# Altium project FitC_Project.PrjPcb (part 2 of 2)

## Sheet Microcontroller_Power_&_RF.SchDoc: Microcontroller Power and RF
size A; DrawnBy: FitC Engineers; Revision: 1; SheetNumber: 3; SheetTotal: 5
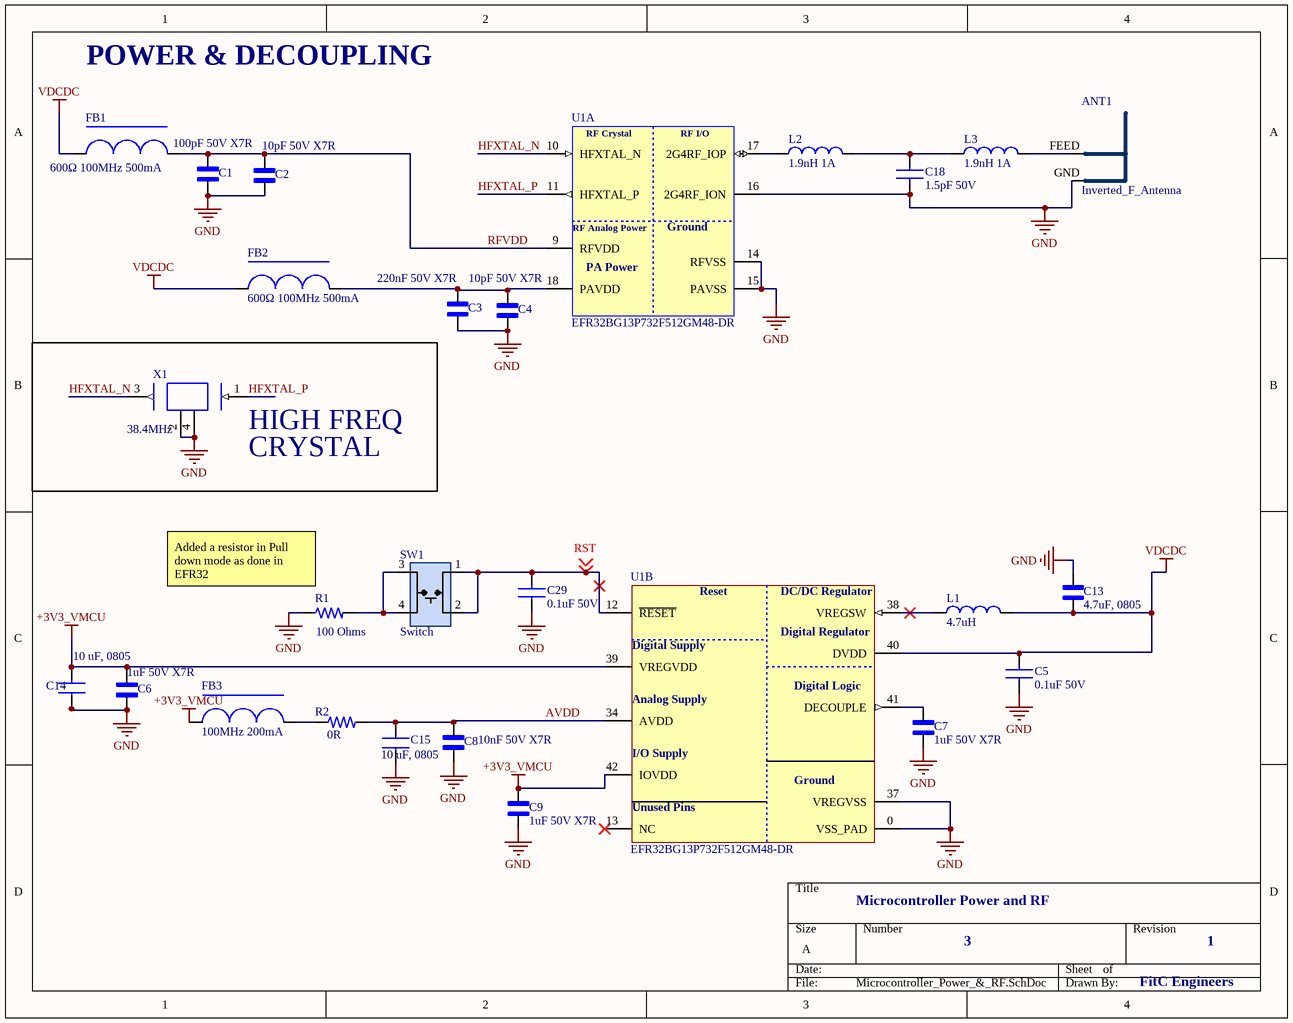
[diagram p2: Microcontroller_Power_&_RF.SchDoc]

### Parts
ANT1  Inverted_F_Antenna  [INV_F_Antenna]  (net tie, no BOM)
C1  100pF 50V X7R  [CAP_0603_1MM]
C2  10pF 50V X7R  [CAP_0603_1MM]
C3  220nF 50V X7R  [CAP_0603_1MM]
C4  10pF 50V X7R  [CAP_0603_1MM]
C5  0.1uF 50V  [CAP_0603_1MM]
C6  1uF 50V X7R  [CAP_0603_1MM]
C7  1uF 50V X7R  [CAP_0603_1MM]
C8  10nF 50V X7R  [CAP_0603_1MM]
C9  1uF 50V X7R  [CAP_0603_1MM]
C13  4.7uF, 0805  [CAP_0805_2012X14]
C14  10 uF, 0805  [CAP_0805_2012X14]
C15  10 uF, 0805  [CAP_0805_2012X14]
C18  1.5pF 50V  [CAP_0402_1mm]
C29  0.1uF 50V  [CAP_0603_1MM]
FB1  600Ω 100MHz 500mA  [RES_0603_1608X06]
FB2  600Ω 100MHz 500mA  [RES_0603_1608X06]
FB3  100MHz 200mA  [RES_0603_1608X06]
L1  4.7uH  [VLS201612CX-100M-1]
L2  1.9nH 1A  [CAP_0402_1mm]
L3  1.9nH 1A  [CAP_0402_1mm]
R1  100 Ohms  [RES_0603_1608X06]
R2  0R  [RES_0603_1608X06]
SW1  Switch  [SWITCH]
U1  EFR32BG13P732F512GM48-DR  [EFR32BG13_48_QFN]  (parts A,B of 3)
X1  38.4MHz  [OSC_38.4MHz]

### Nets
+3V3_VMCU: C6.1 C9.1 C14.2 FB3.1 U1.39(VREGVDD) U1.42(IOVDD)
GND: ANT1.GND C1.2 C2.2 C3.2 C4.2 C5.2 C6.2 C7.2 C8.2 C9.2 C13.1 C14.1 C15.1 C18.2 C29.2 R1.1 U1.0(VSS_PAD) U1.14(RFVSS) U1.15(PAVSS) U1.16(2G4RF_ION) U1.37(VREGVSS) X1.2 X1.4
VDCDC: C5.1 C13.2 FB1.1 FB2.1 L1.2 U1.40(DVDD)
AVDD: C8.1 C15.2 R2.2 U1.34(AVDD)
HFXTAL_N: U1.10(HFXTAL_N) X1.3
HFXTAL_P: U1.11(HFXTAL_P) X1.1
RFVDD: C1.1 C2.1 FB1.2 U1.9(RFVDD)
RST: C29.1 SW1.1 SW1.2 U1.12(~{RESET}) ; off-sheet RST
NetANT1_FEED: ANT1.FEED L3.2
NetC3_1: C3.1 C4.1 FB2.2 U1.18(PAVDD)
NetC7_1: C7.1 U1.41(DECOUPLE)
NetC18_1: C18.1 L2.2 L3.1
NetFB3_2: FB3.2 R2.1
NetL1_1: L1.1 U1.38(VREGSW)
NetL2_1: L2.1 U1.17(2G4RF_IOP)
NetR1_2: R1.2 SW1.3 SW1.4

Not connected (* = marked no-connect by the designer): U1 13(NC)*

### Notes on the sheet
- POWER & DECOUPLING
- (near X1) HIGH FREQ
- (near X1) CRYSTAL
- (near R1) Added a resistor in Pull down mode as done in EFR32
- (in symbol EFR32BG13P732F512GM48-DR, part A) RF Crystal; RF I/O; RF Analog Power; Ground; PA Power
- (in symbol EFR32BG13P732F512GM48-DR, part B) Reset; DC/DC Regulator; Digital Regulator; Digital Supply; Digital Logic; Analog Supply; I/O Supply; Ground; Unused Pins

### Library data of the parts
ANT1 = Inv_F_Antenna
C1 = CL10B101KB8NFNC: 100pF ±10% 50V 0603; Manufacturer: Samsung; Supplier 1: Digi-Key; Manufacturer Part Number: CL10B101KB8NFNC; RoHS: Yes; Category: Ceramic Capacitors; Stock 1: 222247; Pricing 1: 1=0.10000, 10=0.04200, 50=0.02260, 100=0.01850, 500=0.01320, 1000=0.01038 (USD); Mount: Surface Mount; Case/Package: 0603; Case Code (Metric): 1608; Case Code (Imperial): 0603; Contact Plating: Tin; Min Operating Temperature: -55°C; Max Operating Temperature: 125°C; Package Quantity: 1; Packaging: Cut Tape; Capacitance: 100pF; Tolerance: 10%; Voltage Rating: 50V; Dielectric: X7R; Termination: Wraparound; Series: CL; Construction: Flat; Length: 0.063inch; Width: 0.031inch; Thickness: 0.035inch; RoHS Compliant: Yes; ComponentLink1URL: https://datasheet.ciiva.com/25739/cl10b101kb8nfnc-25739520.pdf?src-supplier=Digi-Key; ComponentLink1Description: https://datasheet.ciiva.com/25739/cl10b101kb8nfnc-25739520.pdf?src-supplier=Digi-Key; Supplier Part Number 1: 1276-1908-6-ND
C2 C4 = 06035C100KAT2A: 0603 10 pF 50 V ±10 % Tolerance X7R Surface Mount Multilayer Ceramic Capacitor; Manufacturer: Kyocera AVX; Tolerance: 10%; Supplier 1: Digi-Key; Manufacturer Part Number: 06035C100KAT2A; RoHS: Yes; Category: Ceramic Capacitors; Stock 1: 15388; Pricing 1: 1=0.22000, 10=0.14800, 50=0.08920, 100=0.07520, 500=0.05148, 1000=0.04554 (USD); Mount: Surface Mount; Case/Package: 0603; Number of Pins: 2; Case Code (Metric): 1608; Case Code (Imperial): 0603; Min Operating Temperature: -55°C; Max Operating Temperature: 125°C; Capacitance: 10pF; Voltage Rating: 50V; Packaging: Tape and Reel; Package Quantity: 4000; Dielectric: X7R; Termination: SMD/SMT; Voltage Rating (DC): 50V; Series: -; Construction: Flat; Length: 1.6mm; Width: 0.032inch; Thickness: 0.035inch; Depth: 0.81mm; Radiation Hardening: No; REACH SVHC: Unknown; Lead Free: Lead Free; RoHS Compliant: Yes; ComponentLink1URL: https://datasheet.ciiva.com/204/cx7r-204167.pdf?src-supplier=Digi-Key; ComponentLink1Description: https://datasheet.ciiva.com/204/cx7r-204167.pdf?src-supplier=Digi-Key; ComponentLink2URL: https://datasheet.ciiva.com/5416/cx7r-5416268.pdf?src-supplier=Mouser; ComponentLink2Description: https://datasheet.ciiva.com/5416/cx7r-5416268.pdf?src-supplier=Mouser; ComponentLink3URL: https://datasheet.ciiva.com/28611/1679506-28611544.pdf?src-supplier=Element14; ComponentLink3Description: https://datasheet.ciiva.com/28611/1679506-28611544.pdf?src-supplier=Element14; ComponentLink4URL: https://datasheet.ciiva.com/15212/getdatasheetpartid-317346-15212284.pdf?src-supplier=Verical; ComponentLink4Description: https://datasheet.ciiva.com/15212/getdatasheetpartid-317346-15212284.pdf?src-supplier=Verical; ComponentLink5URL: https://datasheet.ciiva.com/16327/cx7r-16327067.pdf?src-supplier=Future+Electronics; ComponentLink5Description: https://datasheet.ciiva.com/16327/cx7r-16327067.pdf?src-supplier=Future+Electronics; ComponentLink6URL: https://datasheet.ciiva.com/22677/1679506-22677033.pdf?src-supplier=Element14; ComponentLink6Description: https://datasheet.ciiva.com/22677/1679506-22677033.pdf?src-supplier=Element14; Supplier Part Number 1: 478-11375-1-ND
C3 = C1608X7R1H224K080AB: C Series 0603 0.22 uF 50 V ±10 % Tolerance X7R SMT Multilayer Ceramic Capacitor; Manufacturer: TDK; Tolerance: 10%; Supplier 1: Digi-Key; Manufacturer Part Number: C1608X7R1H224K080AB; RoHS: Yes; Category: Ceramic Capacitors; Stock 1: 272861; Pricing 1: 1=0.18000, 10=0.12400, 50=0.07420, 100=0.06270, 500=0.04290, 1000=0.03795 (USD); Mount: Surface Mount; Case/Package: 0603; Number of Pins: 2; Case Code (Metric): 1608; Case Code (Imperial): 0603; Weight: 7.1E-05oz; Dielectric Material: Ceramic; Min Operating Temperature: -55°C; Max Operating Temperature: 125°C; Packaging: Tape and Reel; Package Quantity: 1; Series: C; Capacitance: 220nF; Voltage Rating: 50V; Voltage Rating (DC): 50V; Dielectric: X7R; Termination: SMD/SMT; Resistor Type: Ceramic; Voltage: 50V; Construction: Flat; Length: 1.6mm; Width: 0.031inch; Height: 0.8mm; Thickness: 0.035inch; Depth: 0.8mm; Radiation Hardening: No; REACH SVHC: No SVHC; Lead Free: Lead Free; RoHS Compliant: Yes; ComponentLink1URL: https://datasheet.ciiva.com/26919/getdatasheetpartid-756131-26919196.pdf?src-supplier=Verical; ComponentLink1Description: https://datasheet.ciiva.com/26919/getdatasheetpartid-756131-26919196.pdf?src-supplier=Verical; ComponentLink2URL: https://datasheet.ciiva.com/6291/tdkmlcccaprange-6291851.pdf?src-supplier=Digi-Key; ComponentLink2Description: https://datasheet.ciiva.com/6291/tdkmlcccaprange-6291851.pdf?src-supplier=Digi-Key; ComponentLink3URL: https://datasheet.ciiva.com/6291/tdkmlcccaprange-6291855.pdf?src-supplier=Digi-Key; ComponentLink3Description: https://datasheet.ciiva.com/6291/tdkmlcccaprange-6291855.pdf?src-supplier=Digi-Key; ComponentLink4URL: https://datasheet.ciiva.com/28693/1735394-28693453.pdf?src-supplier=Element14; ComponentLink4Description: https://datasheet.ciiva.com/28693/1735394-28693453.pdf?src-supplier=Element14; ComponentLink5URL: https://datasheet.ciiva.com/16427/e412-c-16427784.pdf?src-supplier=Future+Electronics; ComponentLink5Description: https://datasheet.ciiva.com/16427/e412-c-16427784.pdf?src-supplier=Future+Electronics; ComponentLink6URL: https://datasheet.ciiva.com/23803/1735394-23803003.pdf?src-supplier=Newark; ComponentLink6Description: https://datasheet.ciiva.com/23803/1735394-23803003.pdf?src-supplier=Newark; Supplier Part Number 1: 445-7408-1-ND
C5 C29 = C0603X104K5RAC3121: Cap Ceramic 0.1uF 50V X7R 10% Pad SMD 0603 Flexible Termination 125C Automotive Medical Bag; Manufacturer: KEMET; Supplier 1: Digi-Key; Manufacturer Part Number: C0603X104K5RAC3121; RoHS: No; Category: Ceramic Capacitors; Stock 1: 4337; Pricing 1: 1=0.21000, 10=0.14400, 50=0.08660, 100=0.07320, 500=0.05004, 1000=0.04428 (USD); ComponentLink1URL: https://www.verical.com/server-webapp/html/getDatasheet?partID=788232&src-supplier=Verical; ComponentLink1Description: https://www.verical.com/server-webapp/html/getDatasheet?partID=788232&src-supplier=Verical; Supplier Part Number 1: 399-C0603X104K5RAC3121CT-ND
C6 C7 C9 = 06035C105KAT2A: 0603 1uF Multilayer Ceramic Capacitors 0603 50V X7R 105 10% TOL; Manufacturer: Kyocera AVX; Supplier 1: Digi-Key; Manufacturer Part Number: 06035C105KAT2A; RoHS: Yes; Category: Ceramic Capacitors; Stock 1: 65385; Pricing 1: 1=0.56000, 10=0.39700, 50=0.30000, 100=0.26140, 500=0.19360, 1000=0.16456 (USD); Case/Package: 0603; Capacitance: 1uF; Tolerance: 10%; Dielectric: X7R; Voltage Rating (DC): 50V; RoHS Compliant: Yes; ComponentLink1URL: http://catalogs.avx.com/SurfaceMount.pdf?src-supplier=Digi-Key; ComponentLink1Description: http://catalogs.avx.com/SurfaceMount.pdf?src-supplier=Digi-Key; ComponentLink2URL: http://datasheets.avx.com/X7RDielectric.pdf?src-supplier=Digi-Key; ComponentLink2Description: http://datasheets.avx.com/X7RDielectric.pdf?src-supplier=Digi-Key; Supplier Part Number 1: 478-10073-1-ND
C8 = CL10B103KB8WPJC: Capacitor Ceramic 0.01uF 10% 50V 2-Pin Surface Mount T/R; Manufacturer: Samsung; Supplier 1: Digi-Key; Manufacturer Part Number: CL10B103KB8WPJC; RoHS: Yes; Category: Ceramic Capacitors; Stock 1: 23609; Pricing 1: 1=0.11000, 10=0.08100, 50=0.04620, 100=0.03830, 500=0.02684, 1000=0.02222 (USD); RoHS Compliant: Yes; Supplier Part Number 1: 1276-CL10B103KB8WPJCCT-ND
C13 = CC0805KKX5R8BB475: 0805 4.7 uF 25 V ±10% Tolerance X5R SMT Multilayer Ceramic Capacitor; Manufacturer: Yageo; Voltage Rating (DC): 25V; Supplier 1: Digi-Key; Manufacturer Part Number: CC0805KKX5R8BB475; RoHS: Yes; Category: Ceramic Capacitors; Stock 1: 260911; Pricing 1: 1=0.39000, 10=0.27000, 50=0.18940, 100=0.16230, 500=0.12172, 1000=0.10278 (USD); Mount: Surface Mount; Case/Package: 0805; Case Code (Imperial): 0805; Case Code (Metric): 2012; Weight: 0.000194oz; Min Operating Temperature: -55°C; Max Operating Temperature: 85°C; Tolerance: 10%; Packaging: Tape and Reel; Capacitance: 4.7uF; Voltage Rating: 25V; Dielectric: X5R; Termination: SMD/SMT; Resistor Type: Ceramic; Series: CC; Construction: Flat; Length: 2mm; Width: 0.049inch; Height: 1.25mm; Thickness: 0.057inch; Depth: 1.25mm; Radiation Hardening: No; Lead Free: Lead Free; Halogen Free: Halogen Free; RoHS Compliant: Yes; ComponentLink1URL: https://datasheet.ciiva.com/26946/getdatasheetpartid-788588-26946123.pdf?src-supplier=Verical; ComponentLink1Description: https://datasheet.ciiva.com/26946/getdatasheetpartid-788588-26946123.pdf?src-supplier=Verical; Supplier Part Number 1: 311-1871-1-ND
C14 C15 = GRM21BR61E106KA73K: 0805 25 V 10 uF ±20% Tolerance X5R Monolithic Ceramic Chip Capacitor; Manufacturer: Murata; Capacitance: 10uF; Voltage Rating: 25V; Tolerance: 10%; Supplier 1: Digi-Key; Manufacturer Part Number: GRM21BR61E106KA73K; RoHS: Yes; Category: Ceramic Capacitors; Stock 1: 451324; Pricing 1: 1=0.21000, 10=0.14400, 50=0.08640, 100=0.07290, 500=0.04990, 1000=0.04414, 2500=0.04222, 5000=0.03838 (USD); Mount: Surface Mount; Case/Package: 0805; Weight: 0.000335oz; Min Operating Temperature: -55°C; Max Operating Temperature: 85°C; Packaging: Tape and Reel; Package Quantity: 10000; Dielectric: X5R; Voltage Rating (DC): 25V; Length: 0.079inch; Width: 0.049inch; Thickness: 0.055inch; RoHS Compliant: Yes; ComponentLink1URL: http://www.mouser.com/ds/2/281/c02e-2905.pdf?src-supplier=Mouser; ComponentLink1Description: http://www.mouser.com/ds/2/281/c02e-2905.pdf?src-supplier=Mouser; ComponentLink2URL: http://search.murata.co.jp/Ceramy/image/img/A01X/G101/ENG/GRM21BR61E106KA73-01.pdf?src-supplier=Digi-Key; ComponentLink2Description: http://search.murata.co.jp/Ceramy/image/img/A01X/G101/ENG/GRM21BR61E106KA73-01.pdf?src-supplier=Digi-Key; ComponentLink3URL: https://search.murata.co.jp/Ceramy/image/img/A01X/G101/ENG/GRM21BR61E106KA73-01.pdf?src-supplier=Digi-Key; ComponentLink3Description: https://search.murata.co.jp/Ceramy/image/img/A01X/G101/ENG/GRM21BR61E106KA73-01.pdf?src-supplier=Digi-Key
C18 = GCM1555C1H1R5JA16D: Cap Ceramic 1.5pF 50V C0G 5% Pad SMD 0402 125C Automotive T/R; Manufacturer: Murata; Supplier 1: Digi-Key; Manufacturer Part Number: GCM1555C1H1R5JA16D; RoHS: Yes; Category: Ceramic Capacitors; Stock 1: 77943; Pricing 1: 1=0.10000, 10=0.04700, 50=0.02580, 100=0.02100, 500=0.01502, 1000=0.01180, 2500=0.01072, 5000=0.00987 (USD); Mount: Surface Mount; Case/Package: 0402; Case Code (Imperial): 0402; Case Code (Metric): 1005; Min Operating Temperature: -55°C; Max Operating Temperature: 125°C; Packaging: Cut Tape; Capacitance: 1.5pF; Tolerance: 5%; Voltage Rating: 50V; Ratings: AEC-Q200; ComponentLink1URL: http://search.murata.co.jp/Ceramy/image/img/A01X/G101/ENG/GCM1555C1H1R5JA16-01.pdf?src-supplier=Digi-Key; ComponentLink1Description: http://search.murata.co.jp/Ceramy/image/img/A01X/G101/ENG/GCM1555C1H1R5JA16-01.pdf?src-supplier=Digi-Key
FB1 FB2 = BLM18AG601SN1D: 0603 600Ω ±25% DCR=0.38Ω 500mA; Manufacturer: Murata; Core Material: Ferrite; Material: Steel,Ferrite; Impedance: 600R; Number of Lines: 1; DC Resistance (DCR): 380mR; Shielding: Unshielded; Supplier 1: Arrow Electronics; Manufacturer Part Number: BLM18AG601SN1D; RoHS: Yes; Category: Inductors; Stock 1: 2284000; Pricing 1: 4000=0.02260, 8000=0.02040, 12000=0.01980, 28000=0.01830, 100000=0.01810 (USD); Case/Package: 0603; Number of Pins: 2; Case Code (Metric): 1608; Case Code (Imperial): 0603; Weight: 7.1E-05oz; Min Operating Temperature: -55°C; Max Operating Temperature: 125°C; Package Quantity: 1; Packaging: Tape and Reel; Frequency: 100MHz; Tolerance: 25%; Max Current Rating: 500mA; Current Rating: 500mA; Termination: SMD/SMT; Max DC Current: 500mA; Test Frequency: 100MHz; DC Current: 500mA; Number of Circuits: 1; Length: 1.6mm; Width: 0.8mm; Height: 0.8mm; Depth: 0.8mm; Radiation Hardening: No; RoHS Compliant: Yes; Lead Free: Lead Free; REACH SVHC: No SVHC; Military Standard: Not; ComponentLink1URL: https://datasheet.ciiva.com/19460/1844766-19460213.pdf?src-supplier=Jameco; ComponentLink1Description: https://datasheet.ciiva.com/19460/1844766-19460213.pdf?src-supplier=Jameco; ComponentLink2URL: https://datasheet.ciiva.com/41449/001172228-da-01-en-drossel-0603-600r-1-6x0-8mm-4000st-41449517.pdf?src-supplier=Conrad; ComponentLink2Description: https://datasheet.ciiva.com/41449/001172228-da-01-en-drossel-0603-600r-1-6x0-8mm-4000st-41449517.pdf?src-supplier=Conrad; ComponentLink3URL: https://datasheet.ciiva.com/29347/442309-da-01-en-chip-drossel-0603-600r-500ma-1-6x0-8mm-29347900.pdf?src-supplier=Conrad; ComponentLink3Description: https://datasheet.ciiva.com/29347/442309-da-01-en-chip-drossel-0603-600r-500ma-1-6x0-8mm-29347900.pdf?src-supplier=Conrad; ComponentLink4URL: https://datasheet.ciiva.com/1466/1756147-1466934.pdf?src-supplier=Element14; ComponentLink4Description: https://datasheet.ciiva.com/1466/1756147-1466934.pdf?src-supplier=Element14; ComponentLink5URL: https://datasheet.ciiva.com/1466/1756147-1466933.pdf?src-supplier=Element14; ComponentLink5Description: https://datasheet.ciiva.com/1466/1756147-1466933.pdf?src-supplier=Element14; ComponentLink6URL: https://datasheet.ciiva.com/1012/l0110s0100blm18a-1012018.pdf?src-supplier=Digi-Key; ComponentLink6Description: https://datasheet.ciiva.com/1012/l0110s0100blm18a-1012018.pdf?src-supplier=Digi-Key; ComponentLink7URL: https://datasheet.ciiva.com/1012/l0110s0100blm18a-1012017.pdf?src-supplier=Digi-Key; ComponentLink7Description: https://datasheet.ciiva.com/1012/l0110s0100blm18a-1012017.pdf?src-supplier=Digi-Key; ComponentLink8URL: https://datasheet.ciiva.com/1012/l0110s0100blm18a-1012019.pdf?src-supplier=Digi-Key; ComponentLink8Description: https://datasheet.ciiva.com/1012/l0110s0100blm18a-1012019.pdf?src-supplier=Digi-Key; ComponentLink9URL: https://datasheet.ciiva.com/16210/l0110s0100blm18a-16210006.pdf?src-supplier=Future+Electronics; ComponentLink9Description: https://datasheet.ciiva.com/16210/l0110s0100blm18a-16210006.pdf?src-supplier=Future+Electronics; ComponentLink10URL: https://datasheet.ciiva.com/3081/l0110s0100blm18a-3081613.pdf?src-supplier=Avnet; ComponentLink10Description: https://datasheet.ciiva.com/3081/l0110s0100blm18a-3081613.pdf?src-supplier=Avnet; Supplier Part Number 1: BLM18AG601SN1D
FB3 = 74279266: Ferrite Beads WE-CBF 0603 SMD Bead 100MHz 1000Ohm 200mA; Manufacturer: Wurth Electronics; Tolerance: 25%; Impedance: 1kR; DC Resistance (DCR): 600mR; Inductance: 1.8nH; Shielding: Unshielded; Number of Lines: 1; Supplier 1: Digi-Key; Manufacturer Part Number: 74279266; RoHS: Yes; Category: Ferrite Beads and Chips; Stock 1: 167539; Pricing 1: 1=0.18000, 50=0.17400, 100=0.16000, 500=0.15300, 1000=0.14600, 2000=0.13900 (USD); Case/Package: SMD/SMT; Case Code (Metric): 1608; Case Code (Imperial): 0603; Core Material: Ferrite; Min Operating Temperature: -55°C; Max Operating Temperature: 125°C; Packaging: Tape and Reel; Series: WE-CBF; Current Rating: 200mA; Max DC Current: 200mA; Termination: SMD/SMT; Test Frequency: 100MHz; Max Current Rating: 200mA; Length: 1.6mm; Width: 0.8mm; Height: 0.8mm; Depth: 0.8mm; REACH SVHC: Unknown; Lead Free: Lead Free; RoHS Compliant: Yes; ComponentLink1URL: https://datasheet.ciiva.com/23763/74279266-23763009.pdf?src-supplier=Newark; ComponentLink1Description: https://datasheet.ciiva.com/23763/74279266-23763009.pdf?src-supplier=Newark; ComponentLink2URL: https://datasheet.ciiva.com/11799/0900766b801ef1d0-11799352.pdf?src-supplier=RSComponents; ComponentLink2Description: https://datasheet.ciiva.com/11799/0900766b801ef1d0-11799352.pdf?src-supplier=RSComponents; ComponentLink3URL: https://datasheet.ciiva.com/12395/74279266-221135-12395453.pdf?src-supplier=Mouser; ComponentLink3Description: https://datasheet.ciiva.com/12395/74279266-221135-12395453.pdf?src-supplier=Mouser; ComponentLink4URL: https://datasheet.ciiva.com/14971/74279266-14971192.pdf?src-supplier=Digi-Key; ComponentLink4Description: https://datasheet.ciiva.com/14971/74279266-14971192.pdf?src-supplier=Digi-Key; ComponentLink5URL: https://datasheet.ciiva.com/14634/0900766b801ef1d0-14634816.pdf?src-supplier=Allied+Electronics; ComponentLink5Description: https://datasheet.ciiva.com/14634/0900766b801ef1d0-14634816.pdf?src-supplier=Allied+Electronics; ComponentLink6URL: https://datasheet.ciiva.com/1466/1705901-1466509.pdf?src-supplier=Element14; ComponentLink6Description: https://datasheet.ciiva.com/1466/1705901-1466509.pdf?src-supplier=Element14; ComponentLink7URL: https://datasheet.ciiva.com/22711/1705901-22711422.pdf?src-supplier=Element14; ComponentLink7Description: https://datasheet.ciiva.com/22711/1705901-22711422.pdf?src-supplier=Element14; ComponentLink8URL: https://datasheet.ciiva.com/48698/001087059-da-01-ml-we-cbf-smd-ferrit-74279266-de-en-48698427.pdf?src-supplier=Conrad; ComponentLink8Description: https://datasheet.ciiva.com/48698/001087059-da-01-ml-we-cbf-smd-ferrit-74279266-de-en-48698427.pdf?src-supplier=Conrad; Supplier Part Number 1: 732-4484-1-ND
L1 = VLS201612CX-4R7M-1: 4.7uH Inductor Power Shielded Wirewound  20% 1MHz Ferrite 1.12A 0.252Ohm DCR 0806 T/R; Manufacturer: TDK; Saturation Current: 880mA; DC Resistance (DCR): 252mR; Supplier 1: Digi-Key; Manufacturer Part Number: VLS201612CX-4R7M-1; RoHS: Yes; Category: Fixed Inductors; Stock 1: 74990; Pricing 1: 1=0.41000, 10=0.36200, 25=0.31640, 50=0.27120, 100=0.24860, 250=0.22600, 500=0.21246, 1000=0.16273 (USD); Mount: Surface Mount; Case/Package: Nonstandard; Core Material: Ferrite; Min Operating Temperature: -40°C; Max Operating Temperature: 105°C; Resistor Type: Wirewound; Packaging: Cut Tape; Inductance: 4.7uH; Tolerance: 20%; Current Rating: 1.12A; Shielding: Shielded; Test Frequency: 1MHz; RoHS Compliant: Yes; ComponentLink1URL: https://product.tdk.com/info/en/catalog/datasheets/inductor_commercial_power_vls201612cx-1_en.pdf?src-supplier=Digi-Key; ComponentLink1Description: https://product.tdk.com/info/en/catalog/datasheets/inductor_commercial_power_vls201612cx-1_en.pdf?src-supplier=Digi-Key; Supplier Part Number 1: 445-172965-1-ND
L2 L3 = LQG15WZ1N9S02D: Inductor Chip 1.9nH 0.3nH Tolerance 2-Pin 0402 Paper T/R; Manufacturer: Murata; Supplier 1: Digi-Key; Manufacturer Part Number: LQG15WZ1N9S02D; RoHS: Yes; Category: Fixed Inductors; Stock 1: 7252; Pricing 1: 1=0.14000, 10=0.12900, 25=0.11440, 50=0.09720, 100=0.08580, 250=0.07864, 500=0.07150, 1000=0.06006, 2500=0.05148 (USD); RoHS Compliant: Yes
R1 = RT0603BRD07100RL: Res Thin Film 0603 100 Ohm 0.1% 0.1W(1/10W) ±25ppm/C Pad SMD T/R; Manufacturer: Yageo; Resistance: 100R; Power Rating: 100mW; Voltage Rating: 75V; Temperature Coefficient: 25ppm/°C; Supplier 1: Digi-Key; Manufacturer Part Number: RT0603BRD07100RL; RoHS: Yes; Category: Chip SMD Resistors; Stock 1: 199387; Pricing 1: 1=0.34000, 10=0.28800, 100=0.11260, 1000=0.04716, 2500=0.04322 (USD); Case/Package: 0603; Case Code (Imperial): 0603; Case Code (Metric): 1608; Weight: 7.1E-05oz; Size Code: 0603; Min Operating Temperature: -55°C; Max Operating Temperature: 125°C; Packaging: Tape and Reel; Tolerance: 0.1%; Package Quantity: 5000; Resistor Type: Thin Film; Termination: SMD/SMT; Number of Terminations: 2; Max Power Dissipation: 100mW; Voltage Rating (DC): 75V; Features: Moisture Resistant; Series: RT; Construction: Rectangular; Length: 1.6mm; Width: 0.8mm; Height: 0.022inch; Depth: 0.8mm; Military Standard: Not; Lead Free: Lead Free; RoHS Compliant: Yes; ComponentLink1URL: https://datasheet.ciiva.com/2585/pyu-rt-1-to-0-05-rohs-l-4-2585609.pdf?src-supplier=Digi-Key; ComponentLink1Description: https://datasheet.ciiva.com/2585/pyu-rt-1-to-0-05-rohs-l-4-2585609.pdf?src-supplier=Digi-Key; ComponentLink2URL: https://datasheet.ciiva.com/46635/pyu-rt-1-to-0-05-rohs-l-5-46635113.pdf?src-supplier=Digi-Key; ComponentLink2Description: https://datasheet.ciiva.com/46635/pyu-rt-1-to-0-05-rohs-l-5-46635113.pdf?src-supplier=Digi-Key; Supplier Part Number 1: YAG1497CT-ND
R2 = RMCF0603ZT0R00: Res Thkflm 0603 0 Ohm Jumper 1/10W 100Ppm/ C Smd Rohs Compliant: Yes; Manufacturer: Stackpole Electronics; Power Rating: 100mW; Current Rating: 1A; Working Voltage: 75V; Supplier 1: Digi-Key; Manufacturer Part Number: RMCF0603ZT0R00; RoHS: Yes; Category: Chip SMD Resistors; Pricing 1: 1=0.10000, 10=0.01300, 25=0.00960, 50=0.00720, 100=0.00530, 250=0.00404, 500=0.00324, 1000=0.00238 (USD); Mount: Surface Mount; Case/Package: 0603; Case Code (Metric): 1608; Case Code (Imperial): 0603; Contact Plating: Tin,Matte; Min Operating Temperature: -55°C; Max Operating Temperature: 155°C; Resistance: 0R; Packaging: Tape and Reel; Resistor Type: Thick Film; Number of Terminations: 2; Max Power Dissipation: 100mW; Features: Automotive AEC-Q200; Series: RMCF; Construction: Rectangular; Length: 1.55mm; Width: 0.031inch; Height: 0.022inch; Depth: 0.8mm; Radiation Hardening: No; Lead Free: Lead Free; Military Standard: Not; RoHS Compliant: Yes; ComponentLink1URL: https://www.seielect.com/catalog/SEI-Packaging.pdf?src-supplier=Digi-Key; ComponentLink1Description: https://www.seielect.com/catalog/SEI-Packaging.pdf?src-supplier=Digi-Key; ComponentLink2URL: https://www.seielect.com/Catalog/SEI-RMCF_RMCP.pdf?src-supplier=Digi-Key; ComponentLink2Description: https://www.seielect.com/Catalog/SEI-RMCF_RMCP.pdf?src-supplier=Digi-Key; ComponentLink3URL: https://www.seielect.com/catalog/SEI-Packaging.pdf?src-supplier=Arrow+Electronics; ComponentLink3Description: https://www.seielect.com/catalog/SEI-Packaging.pdf?src-supplier=Arrow+Electronics; ComponentLink4URL: https://www.seielect.com/catalog/SEI-Packaging.pdf?src-supplier=Avnet; ComponentLink4Description: https://www.seielect.com/catalog/SEI-Packaging.pdf?src-supplier=Avnet; ComponentLink5URL: https://www.seielect.com/catalog/SEI-Packaging.pdf?src-supplier=Verical; ComponentLink5Description: https://www.seielect.com/catalog/SEI-Packaging.pdf?src-supplier=Verical; Supplier Part Number 1: RMCF0603ZT0R00CT-ND
SW1 = RKB2SJM250SMTR LFS (2): Switch Tactile SPST-NO Button Gull Wing 50mA 12VDC 100000Cycle 180gf Surface Mount T/R; Manufacturer: C&K Components; Supplier 1: Digi-Key; Manufacturer Part Number: RKB2SJM250SMTR LFS; Category: Connectors; Stock 1: 5895; Pricing 1: 1=0.19000, 10=0.18600, 25=0.17640, 100=0.16050, 250=0.15088, 500=0.13804, 1000=0.11556 (USD); ComponentLink1URL: https://datasheet.octopart.com/RKB2SJM250SMTR-LFS-C%26K-Components-datasheet-151570462.pdf?src-supplier=Allied+Electronics; ComponentLink1Description: https://datasheet.octopart.com/RKB2SJM250SMTR-LFS-C%26K-Components-datasheet-151570462.pdf?src-supplier=Allied+Electronics; Supplier Part Number 1: 108-RKB2SJM250SMTRLFSCT-ND
U1 = EFR32BG13P732F512GM48-DR: Blue Gecko QFN48 2.4 G 19 dB BLE/Proprietary 512 kB 64 kB(RAM) 31GPIO; Manufacturer: Silicon Labs; Supplier 1: Digi-Key; Manufacturer Part Number: EFR32BG13P732F512GM48-DR; Category: RF Receivers, Transceivers; ComponentLink1URL: https://datasheet.octopart.com/EFR32BG13P732F512GM48-DR-Silicon-Labs-datasheet-150822224.pdf?src-supplier=Silicon+Labs; ComponentLink1Description: https://datasheet.octopart.com/EFR32BG13P732F512GM48-DR-Silicon-Labs-datasheet-150822224.pdf?src-supplier=Silicon+Labs; ComponentLink2URL: https://datasheet.octopart.com/EFR32BG13P732F512GM48-DR-Silicon-Labs-datasheet-142345357.pdf?src-supplier=Silicon+Labs+SCT; ComponentLink2Description: https://datasheet.octopart.com/EFR32BG13P732F512GM48-DR-Silicon-Labs-datasheet-142345357.pdf?src-supplier=Silicon+Labs+SCT; ComponentLink3URL: https://datasheet.octopart.com/EFR32BG13P732F512GM48-DR-Silicon-Labs-datasheet-150822225.pdf?src-supplier=Farnell; ComponentLink3Description: https://datasheet.octopart.com/EFR32BG13P732F512GM48-DR-Silicon-Labs-datasheet-150822225.pdf?src-supplier=Farnell; Supplier Part Number 1: EFR32BG13P732F512GM48-DR-ND
X1 = RH100-38.400-10-F-1010-TR: Crystal 38.4000MHZ 10PF SMD; Manufacturer: Raltron Electronics; Supplier 1: Digi-Key; Manufacturer Part Number: RH100-38.400-10-F-1010-TR; RoHS: Yes; Stock 1: 6000; Pricing 1: 1=0.39000, 10=0.32400, 50=0.29180, 100=0.25940, 500=0.24640, 1000=0.20750 (USD)

## Sheet Sensors.SchDoc: Sensors
size 279 x 203 mm; DrawnBy: FitC Engineers; Revision: 1; SheetNumber: 4; SheetTotal: 5
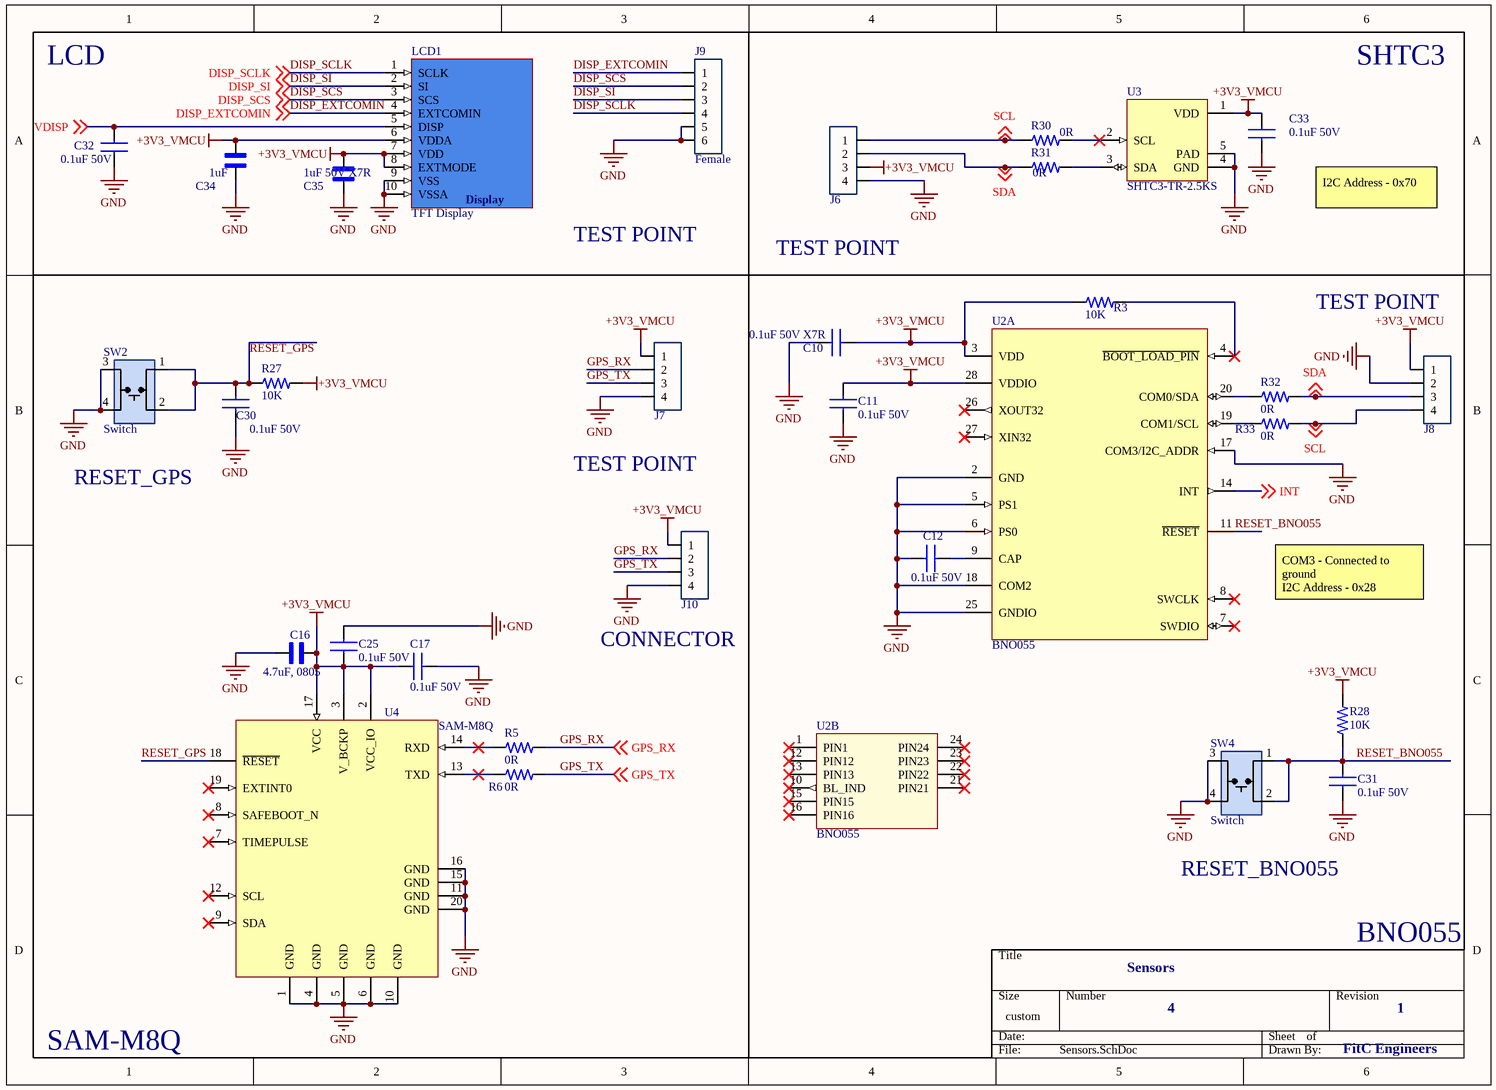
[diagram p3: Sensors.SchDoc]

### Parts
C10  0.1uF 50V X7R  [CAP_0603_1MM]
C11  0.1uF 50V  [CAP_0603_1MM]
C12  0.1uF 50V  [CAP_0603_1MM]
C16  4.7uF, 0805  [CAP_0805_2012X14]
C17  0.1uF 50V  [CAP_0603_1MM]
C25  0.1uF 50V  [CAP_0603_1MM]
C30  0.1uF 50V  [CAP_0603_1MM]
C31  0.1uF 50V  [CAP_0603_1MM]
C32  0.1uF 50V  [CAP_0603_1MM]
C33  0.1uF 50V  [CAP_0603_1MM]
C34  1uF  [CAP_0603_1MM]
C35  1uF 50V X7R  [CAP_0603_1MM]
J6  J_4_PIN_HEADER  [4_PIN_100MIL]  (value not drawn)
J7  J_4_PIN_HEADER  [4_PIN_100MIL]  (value not drawn)
J8  J_4_PIN_HEADER  [4_PIN_100MIL]  (value not drawn)
J9  value Female  [6_PIN_100MIL]  (hidden comment: PPTC061LFBN-RC)
J10  J_4_PIN_HEADER  [4_PIN_100MIL]  (value not drawn)
LCD1  TFT Display  [10Pin_LCD_Connector]
R3  10K  [RES_0603_1608X06]
R5  0R  [RES_0603_1608X06]
R6  0R  [RES_0603_1608X06]
R27  10K  [RES_0603_1608X06]
R28  10K  [RES_0603_1608X06]
R30  0R  [RES_0603_1608X06]
R31  0R  [RES_0603_1608X06]
R32  0R  [RES_0603_1608X06]
R33  0R  [RES_0603_1608X06]
SW2  Switch  [SWITCH]
SW4  Switch  [SWITCH]
U2  BNO055  [BNO055_LGA]  (parts A,B of 2)
U3  SHTC3-TR-2.5KS  [SHTC3_SON]
U4  SAM-M8Q  [SAM-M8]

### Nets
+3V3_VMCU: C10.2 C11.1 C16.1 C17.2 C25.2 C33.2 C34.1 C35.1 J6.3 J7.1 J8.1 J10.1 LCD1.6(VDDA) LCD1.7(VDD) LCD1.8(EXTMODE) R3.1 R27.2 R28.2 U2.3(VDD) U2.28(VDDIO) U3.1(VDD) U4.2(VCC_IO) U4.3(V_BCKP) U4.17(VCC)
GND: C10.1 C11.2 C12.1 C16.2 C17.1 C25.1 C30.2 C31.2 C32.2 C33.1 C34.2 C35.2 J6.4 J7.4 J8.2 J9.5 J9.6 J10.4 LCD1.9(VSS) LCD1.10(VSSA) SW2.3 SW2.4 SW4.3 SW4.4 U2.2(GND) U2.5(PS1) U2.6(PS0) U2.17(COM3/I2C_ADDR) U2.18(COM2) U2.25(GNDIO) U3.4(GND) U3.5(PAD) U4.1(GND) U4.4(GND) U4.5(GND) U4.6(GND) U4.10(GND) U4.11(GND) U4.15(GND) U4.16(GND) U4.20(GND)
DISP_EXTCOMIN: J9.1 LCD1.4(EXTCOMIN) ; off-sheet DISP_EXTCOMIN
DISP_SCLK: J9.4 LCD1.1(SCLK) ; off-sheet DISP_SCLK
DISP_SCS: J9.2 LCD1.3(SCS) ; off-sheet DISP_SCS
DISP_SI: J9.3 LCD1.2(SI) ; off-sheet DISP_SI
GPS_RX: J7.2 J10.2 R5.2 ; off-sheet GPS_RX
GPS_TX: J7.3 J10.3 R6.2 ; off-sheet GPS_TX
INT: U2.14(INT) ; off-sheet INT
RESET_BNO055: C31.1 R28.1 SW4.1 SW4.2 U2.11(~{RESET})
RESET_GPS: C30.1 R27.1 SW2.1 SW2.2 U4.18(~{RESET})
SCL: J6.1 J8.4 R30.1 R33.2 ; off-sheet SCL
SDA: J6.2 J8.3 R31.1 R32.2 ; off-sheet SDA
VDISP: C32.1 LCD1.5(DISP) ; off-sheet VDISP
NetC12_2: C12.2 U2.9(CAP)
NetR3_2: R3.2 U2.4(~{BOOT_LOAD_PIN})
NetR5_1: R5.1 U4.14(RXD)
NetR6_1: R6.1 U4.13(TXD)
NetR30_2: R30.2 U3.2(SCL)
NetR31_2: R31.2 U3.3(SDA)
NetR32_1: R32.1 U2.20(COM0/SDA)
NetR33_1: R33.1 U2.19(COM1/SCL)

Not connected (* = marked no-connect by the designer): U2 1(PIN1)* 7(SWDIO)* 8(SWCLK)* 10(BL_IND)* 12(PIN12)* 13(PIN13)* 15(PIN15)* 16(PIN16)* 21(PIN21)* 22(PIN22)* 23(PIN23)* 24(PIN24)* 26(XOUT32)* 27(XIN32)*; U4 7(TIMEPULSE)* 8(SAFEBOOT_N)* 9(SDA)* 12(SCL)* 19(EXTINT0)*

### Notes on the sheet
- LCD
- SHTC3
- I2C Address - 0x70
- TEST POINT
- RESET_GPS
- COM3 - Connected to ground
  I2C Address - 0x28
- (near J10) CONNECTOR
- RESET_BNO055
- BNO055
- SAM-M8Q
- (in symbol LS013B7DH03) Display

### Library data of the parts
C10-C12 C30-C33 = C0603X104K5RAC3121: as C5 on sheet Microcontroller_Power_&_RF; Supplier 1: Digi-Key; Manufacturer Part Number: C0603X104K5RAC3121; RoHS: No; Category: Ceramic Capacitors; Stock 1: 4337; Pricing 1: 1=0.21000, 10=0.14400, 50=0.08660, 100=0.07320, 500=0.05004, 1000=0.04428 (USD); ComponentLink1URL: https://www.verical.com/server-webapp/html/getDatasheet?partID=788232&src-supplier=Verical; ComponentLink1Description: https://www.verical.com/server-webapp/html/getDatasheet?partID=788232&src-supplier=Verical; Supplier Part Number 1: 399-C0603X104K5RAC3121CT-ND
C16 = CC0805KKX5R8BB475: as C13 on sheet Microcontroller_Power_&_RF; Supplier 1: Digi-Key; Manufacturer Part Number: CC0805KKX5R8BB475; RoHS: Yes; Category: Ceramic Capacitors; Stock 1: 260911; Pricing 1: 1=0.39000, 10=0.27000, 50=0.18940, 100=0.16230, 500=0.12172, 1000=0.10278 (USD); Mount: Surface Mount; Case/Package: 0805; Case Code (Imperial): 0805; Case Code (Metric): 2012; Weight: 0.000194oz; Min Operating Temperature: -55°C; Max Operating Temperature: 85°C; Tolerance: 10%; Packaging: Tape and Reel; Capacitance: 4.7uF; Voltage Rating: 25V; Dielectric: X5R; Termination: SMD/SMT; Resistor Type: Ceramic; Series: CC; Construction: Flat; Length: 2mm; Width: 0.049inch; Height: 1.25mm; Thickness: 0.057inch; Depth: 1.25mm; Radiation Hardening: No; Lead Free: Lead Free; Halogen Free: Halogen Free; RoHS Compliant: Yes; ComponentLink1URL: https://datasheet.ciiva.com/26946/getdatasheetpartid-788588-26946123.pdf?src-supplier=Verical; ComponentLink1Description: https://datasheet.ciiva.com/26946/getdatasheetpartid-788588-26946123.pdf?src-supplier=Verical; Supplier Part Number 1: 311-1871-1-ND
C17 C25 = C0603X104K5RAC3121_1: Cap Ceramic 0.1uF 50V X7R 10% Pad SMD 0603 Flexible Termination 125C Automotive Medical Bag; Manufacturer: KEMET; Supplier 1: Digi-Key; Manufacturer Part Number: C0603X104K5RAC3121; RoHS: No; Category: Ceramic Capacitors; Stock 1: 4337; Pricing 1: 1=0.21000, 10=0.14400, 50=0.08660, 100=0.07320, 500=0.05004, 1000=0.04428 (USD); ComponentLink1URL: https://www.verical.com/server-webapp/html/getDatasheet?partID=788232&src-supplier=Verical; ComponentLink1Description: https://www.verical.com/server-webapp/html/getDatasheet?partID=788232&src-supplier=Verical; Supplier Part Number 1: 399-C0603X104K5RAC3121CT-ND
C34 C35 = 06035C105KAT2A: as C6 on sheet Microcontroller_Power_&_RF; Supplier 1: Digi-Key; Manufacturer Part Number: 06035C105KAT2A; RoHS: Yes; Category: Ceramic Capacitors; Stock 1: 65385; Pricing 1: 1=0.56000, 10=0.39700, 50=0.30000, 100=0.26140, 500=0.19360, 1000=0.16456 (USD); Case/Package: 0603; Capacitance: 1uF; Tolerance: 10%; Dielectric: X7R; Voltage Rating (DC): 50V; RoHS Compliant: Yes; ComponentLink1URL: http://catalogs.avx.com/SurfaceMount.pdf?src-supplier=Digi-Key; ComponentLink1Description: http://catalogs.avx.com/SurfaceMount.pdf?src-supplier=Digi-Key; ComponentLink2URL: http://datasheets.avx.com/X7RDielectric.pdf?src-supplier=Digi-Key; ComponentLink2Description: http://datasheets.avx.com/X7RDielectric.pdf?src-supplier=Digi-Key; Supplier Part Number 1: 478-10073-1-ND
J6-J8 J10 = J_4_PIN_HEADER: 4 Position Header Connector 0.100" (2.54mm) Through Hole Tin
J9 = JF_6_PIN_FEMALE: 6 Position Header Connector 0.100" (2.54mm) Through Hole Tin; Digikey Link: https://www.digikey.com/product-detail/en/PPTC061LFBN-RC/S7004-ND/810145/?itemSeq=304982353; Digikey Part: S7004-ND; LCSC Part#: DNP
LCD1 = LS013B7DH03: LCD TFT 1.28" 128X128 FPC / 1.28in LCD Monitor without Touchscreen 128x128Pixels; Manufacturer: Sharp; Touchscreen: No; Operating Supply Voltage: 3V; Interface: Serial; Diagonal Size: 1.28inch; Supplier 1: Digi-Key; Manufacturer Part Number: LS013B7DH03; RoHS: Yes; Category: LCD, OLED, Graphic Displays; Stock 1: 1435; Pricing 1: 1=12.14000, 10=8.80700, 80=7.27700, 440=6.37316, 1120=6.02553 (USD); Min Operating Temperature: -10°C; Max Operating Temperature: 60°C; Package Quantity: 560; Resolution (height): 128pixel; Resolution (width): 128pixel; Packaging: Tray; Series: -; Lead Free: Lead Free; ComponentLink1URL: https://datasheet.ciiva.com/12422/ls013b7dh0320spec-sma-224806-12422656.pdf?src-supplier=Mouser; ComponentLink1Description: https://datasheet.ciiva.com/12422/ls013b7dh0320spec-sma-224806-12422656.pdf?src-supplier=Mouser; Supplier Part Number 1: 425-2903-ND
R3 R27 R28 = RNCP0603FTD10K0: Res Thin Film 0603 10K Ohm 1% 1/8W ±100ppm/°C Molded SMD SMD Paper T/R; Manufacturer: Stackpole Electronics; Resistance: 10kR; Max Power Dissipation: 125mW; Supplier 1: Digi-Key; Manufacturer Part Number: RNCP0603FTD10K0; RoHS: Yes; Category: Chip SMD Resistors; Stock 1: 9; Pricing 1: 1=0.10000, 10=0.06100, 100=0.02480, 1000=0.01113, 2500=0.00966 (USD); Mount: Surface Mount; Case/Package: 0603; Case Code (Metric): 1608; Case Code (Imperial): 0603; Contact Plating: Tin,Matte; Min Operating Temperature: -55°C; Max Operating Temperature: 155°C; Packaging: Tape and Reel; Tolerance: 1%; Resistor Type: Thin Film; Number of Terminations: 2; Temperature Coefficient: 100ppm/°C; Features: Moisture Resistant,Anti-Sulfur; Series: RNCP; Length: 0.059inch; Width: 0.031inch; Height: 0.02inch; Radiation Hardening: No; Lead Free: Lead Free; RoHS Compliant: Yes; ComponentLink1URL: https://www.seielect.com/Catalog/SEI-rncp.pdf?src-supplier=Avnet; ComponentLink1Description: https://www.seielect.com/Catalog/SEI-rncp.pdf?src-supplier=Avnet; ComponentLink2URL: https://www.seielect.com/Catalog/SEI-rncp.pdf?src-supplier=Digi-Key; ComponentLink2Description: https://www.seielect.com/Catalog/SEI-rncp.pdf?src-supplier=Digi-Key; ComponentLink3URL: https://www.seielect.com/catalog/SEI-Packaging.pdf?src-supplier=Digi-Key; ComponentLink3Description: https://www.seielect.com/catalog/SEI-Packaging.pdf?src-supplier=Digi-Key; Supplier Part Number 1: RNCP0603FTD10K0CT-ND
R5 R6 R30-R33 = RMCF0603ZT0R00: as R2 on sheet Microcontroller_Power_&_RF; Supplier 1: Digi-Key; Manufacturer Part Number: RMCF0603ZT0R00; RoHS: Yes; Category: Chip SMD Resistors; Pricing 1: 1=0.10000, 10=0.01300, 25=0.00960, 50=0.00720, 100=0.00530, 250=0.00404, 500=0.00324, 1000=0.00238 (USD); Mount: Surface Mount; Case/Package: 0603; Case Code (Metric): 1608; Case Code (Imperial): 0603; Contact Plating: Tin,Matte; Min Operating Temperature: -55°C; Max Operating Temperature: 155°C; Resistance: 0R; Packaging: Tape and Reel; Resistor Type: Thick Film; Number of Terminations: 2; Max Power Dissipation: 100mW; Features: Automotive AEC-Q200; Series: RMCF; Construction: Rectangular; Length: 1.55mm; Width: 0.031inch; Height: 0.022inch; Depth: 0.8mm; Radiation Hardening: No; Lead Free: Lead Free; Military Standard: Not; RoHS Compliant: Yes; ComponentLink1URL: https://www.seielect.com/catalog/SEI-Packaging.pdf?src-supplier=Digi-Key; ComponentLink1Description: https://www.seielect.com/catalog/SEI-Packaging.pdf?src-supplier=Digi-Key; ComponentLink2URL: https://www.seielect.com/Catalog/SEI-RMCF_RMCP.pdf?src-supplier=Digi-Key; ComponentLink2Description: https://www.seielect.com/Catalog/SEI-RMCF_RMCP.pdf?src-supplier=Digi-Key; ComponentLink3URL: https://www.seielect.com/catalog/SEI-Packaging.pdf?src-supplier=Arrow+Electronics; ComponentLink3Description: https://www.seielect.com/catalog/SEI-Packaging.pdf?src-supplier=Arrow+Electronics; ComponentLink4URL: https://www.seielect.com/catalog/SEI-Packaging.pdf?src-supplier=Avnet; ComponentLink4Description: https://www.seielect.com/catalog/SEI-Packaging.pdf?src-supplier=Avnet; ComponentLink5URL: https://www.seielect.com/catalog/SEI-Packaging.pdf?src-supplier=Verical; ComponentLink5Description: https://www.seielect.com/catalog/SEI-Packaging.pdf?src-supplier=Verical; Supplier Part Number 1: RMCF0603ZT0R00CT-ND
SW2 SW4 = RKB2SJM250SMTR LFS (2): as SW1 on sheet Microcontroller_Power_&_RF; Supplier 1: Digi-Key; Manufacturer Part Number: RKB2SJM250SMTR LFS; Category: Connectors; Stock 1: 5895; Pricing 1: 1=0.19000, 10=0.18600, 25=0.17640, 100=0.16050, 250=0.15088, 500=0.13804, 1000=0.11556 (USD); ComponentLink1URL: https://datasheet.octopart.com/RKB2SJM250SMTR-LFS-C%26K-Components-datasheet-151570462.pdf?src-supplier=Allied+Electronics; ComponentLink1Description: https://datasheet.octopart.com/RKB2SJM250SMTR-LFS-C%26K-Components-datasheet-151570462.pdf?src-supplier=Allied+Electronics; Supplier Part Number 1: 108-RKB2SJM250SMTRLFSCT-ND
U2 = BNO055: BNO055 Series 1.7 to 3.6 V Intelligent 9-Axis Absolute Orientation Sensor-LGA-28; Manufacturer: Bosch; Sensor Type: Accelerometer,Gyroscope,Magnetometer,3 Axis; Output Type: I2C; Supplier 1: Future Electronics; Manufacturer Part Number: BNO055; RoHS: No; Category: Inertial Measurement Units (IMUs); Pricing 1: 4000=7.71000 (USD); Mount: Surface Mount; Case/Package: LGA; Min Operating Temperature: -40°C; Max Operating Temperature: 85°C; Packaging: Tape and Reel; Lead Free: Lead Free; ComponentLink1URL: https://ae-bst.resource.bosch.com/media/_tech/media/application_notes/BST-BNO055-HS000.pdf ?src-supplier=Digi-Key; ComponentLink1Description: https://ae-bst.resource.bosch.com/media/_tech/media/application_notes/BST-BNO055-HS000.pdf ?src-supplier=Digi-Key; Supplier Part Number 1: 9049845
U3 = SHTC3-TR-2.5KS: Relative Humidity & Temperature Sensor, consumer focus; Manufacturer: Sensirion; Supplier 1: Digi-Key; Manufacturer Part Number: SHTC3-TR-2.5KS; RoHS: No; Stock 1: 9382; Pricing 1: 1=3.32000, 5=3.08800, 10=2.56500, 25=2.13760, 50=1.90000, 100=1.80500, 500=1.52000, 1000=1.42500 (USD); Supplier Part Number 1: 1649-SHTC3-TR-2.5KSCT-ND
U4 = SAM-M8Q-0-10: Rf Rx Galileo 1.575GHZ/1.602GHZ; Manufacturer: u-blox; Interface: I2C,SPI,USB,UART; Sensitivity: -165dBm; Data Rate: 400Kbps; Supplier 1: Digi-Key; Manufacturer Part Number: SAM-M8Q-0-10; RoHS: Yes; Category: RF Receivers, Transceivers; Stock 1: 14250; Pricing 1: 1=31.50000, 10=25.91000, 50=21.24000, 100=17.04010 (USD); Case/Package: SMD/SMT; Min Operating Temperature: -40°C; Max Operating Temperature: 85°C; Packaging: Tape and Reel; Frequency: 1.602GHz; ComponentLink1URL: https://www.u-blox.com/sites/default/files/SAM-M8Q_ProductSummary_%28UBX-15027452%29.pdf?src-supplier=Digi-Key; ComponentLink1Description: https://www.u-blox.com/sites/default/files/SAM-M8Q_ProductSummary_%28UBX-15027452%29.pdf?src-supplier=Digi-Key; ComponentLink2URL: https://www.u-blox.com/sites/default/files/SAM-M8Q_DataSheet_%28UBX-16012619%29.pdf?src-supplier=Digi-Key; ComponentLink2Description: https://www.u-blox.com/sites/default/files/SAM-M8Q_DataSheet_%28UBX-16012619%29.pdf?src-supplier=Digi-Key; Supplier Part Number 1: 672-1054-1-ND

## Sheet Microcontroller_IO.SchDoc: Microcontroller_IO
size A; DrawnBy: FitC Engineers; Revision: 1; SheetNumber: 5; SheetTotal: 5
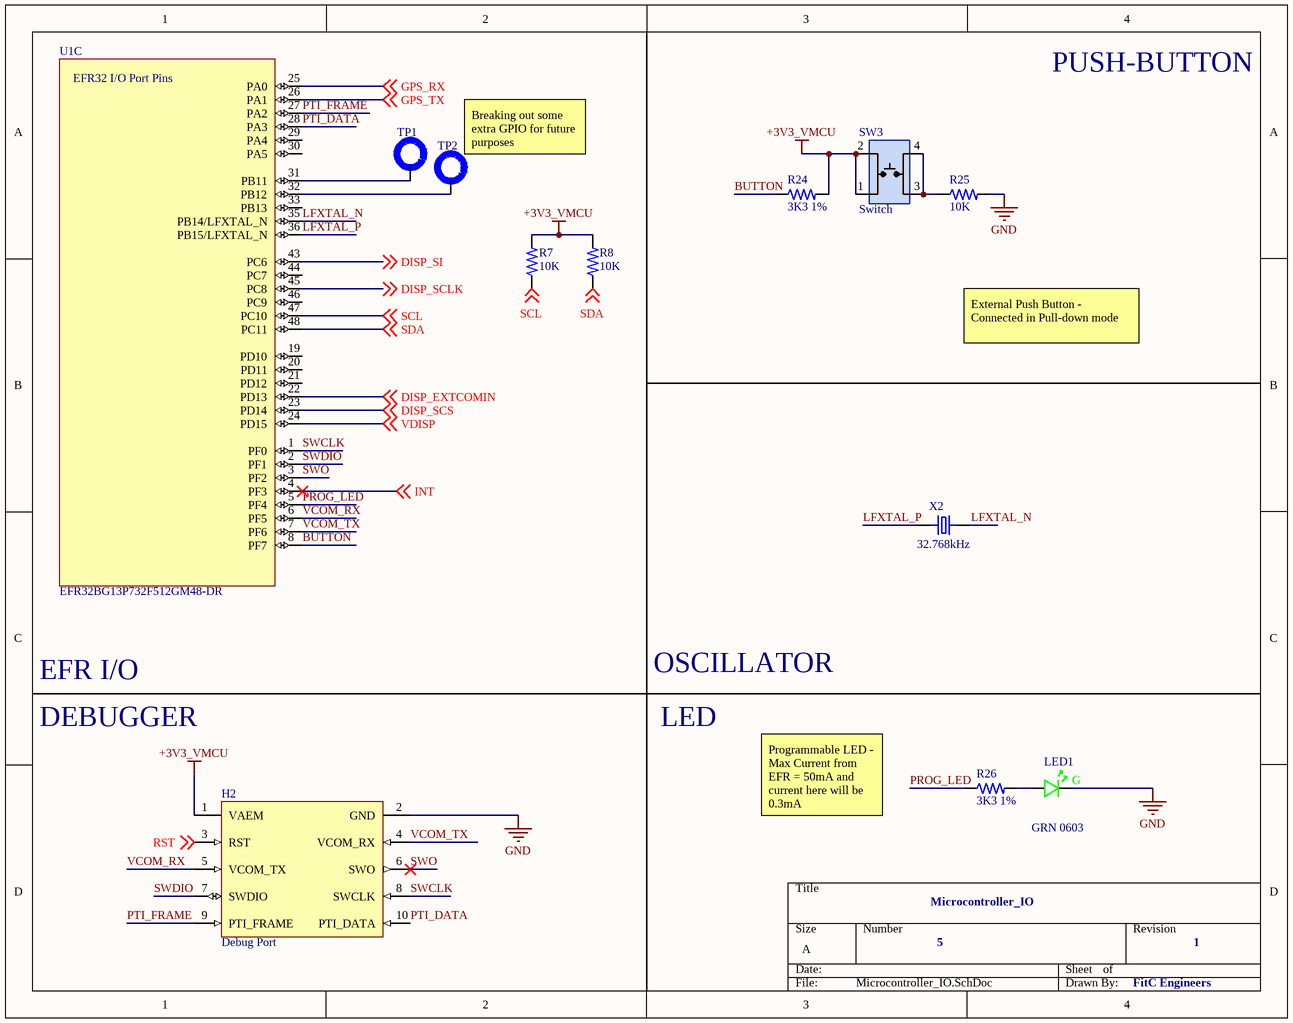
[diagram p4: Microcontroller_IO.SchDoc]

### Parts
H2  Debug Port  [Amphenol_20021121_0]
LED1  GRN 0603  [LED_0603_GRN_WL-SMCW]
R7  10K  [RES_0603_1608X06]
R8  10K  [RES_0603_1608X06]
R24  3K3 1%  [RES_0603_1608X06]
R25  10K  [RES_0603_1608X06]
R26  3K3 1%  [RES_0603_1608X06]
SW3  Switch  [SWITCH]
TP1  Test Pad for Testing  [1mm Test Pad]  (value not drawn)  (no BOM)
TP2  Test Pad for Testing  [1mm Test Pad]  (value not drawn)  (no BOM)
U1  EFR32BG13P732F512GM48-DR  [EFR32BG13_48_QFN]  (part C of 3)
X2  32.768kHz  [XTAL_ECS-.327-7-34B-TR]

### Nets
+3V3_VMCU: H2.1(VAEM) R7.2 R8.2 R24.2 SW3.1 SW3.2
GND: H2.2(GND) LED1.C R25.2
BUTTON: R24.1 U1.8(PF7)
DISP_EXTCOMIN: U1.22(PD13) ; off-sheet DISP_EXTCOMIN
DISP_SCLK: U1.45(PC8) ; off-sheet DISP_SCLK
DISP_SCS: U1.23(PD14) ; off-sheet DISP_SCS
DISP_SI: U1.43(PC6) ; off-sheet DISP_SI
GPS_RX: U1.25(PA0) ; off-sheet GPS_RX
GPS_TX: U1.26(PA1) ; off-sheet GPS_TX
INT: U1.4(PF3) ; off-sheet INT
LFXTAL_N: U1.35(PB14/LFXTAL_N) X2.2
LFXTAL_P: U1.36(PB15/LFXTAL_N) X2.1
PROG_LED: R26.1 U1.5(PF4)
PTI_DATA: H2.10(PTI_DATA) U1.28(PA3)
PTI_FRAME: H2.9(PTI_FRAME) U1.27(PA2)
RST: H2.3(RST) ; off-sheet RST
SCL: R7.1 U1.47(PC10) ; off-sheet SCL
SDA: R8.1 U1.48(PC11) ; off-sheet SDA
SWCLK: H2.8(SWCLK) U1.1(PF0)
SWDIO: H2.7(SWDIO) U1.2(PF1)
SWO: H2.6(SWO) U1.3(PF2)
VCOM_RX: H2.5(VCOM_TX) U1.6(PF5)
VCOM_TX: H2.4(VCOM_RX) U1.7(PF6)
VDISP: U1.24(PD15) ; off-sheet VDISP
NetLED1_A: LED1.A R26.2
NetR25_1: R25.1 SW3.3 SW3.4
NetTP1_1: TP1.1 U1.31(PB11)
NetTP2_1: TP2.1 U1.32(PB12)

Not connected (* = marked no-connect by the designer): U1 19(PD10) 20(PD11) 21(PD12) 29(PA4) 30(PA5) 33(PB13) 44(PC7) 46(PC9)

### Notes on the sheet
- PUSH-BUTTON
- (near TP2) Breaking out some extra GPIO for future purposes
- External Push Button - Connected in Pull-down mode
- EFR I/O
- OSCILLATOR
- DEBUGGER
- LED
- Programmable LED - Max Current from EFR = 50mA and current here will be 0.3mA
- (in symbol 150060GS75000) G
- (in symbol EFR32BG13P732F512GM48-DR, part C) EFR32 I/O Port Pins

### Library data of the parts
H2 = 20021121-00010C1LF: CONN HEADER SMD 10POS 1.27MM. Connector Header Surface Mount 10 position 0.050"; Manufacturer: Amphenol ICC / FCI; Supplier 1: Digi-Key; Manufacturer Part Number: 20021121-00010C1LF; RoHS: No; Category: Headers and Wire Housings
LED1 = 150060GS75000: LED, 0603, GREEN, 430MCD, 520NM; Manufacturer: Wurth Electronics; Dynamic Catalog: 0603 Rectangle with Flat Top Chip LEDs; 3D Model: SMCW_0603.igs / SMCW_0603.stp / SMCW_0603.wrl; Wavelength - Peak: 515nm; Voltage - Forward (Vf) (Typ): 3.2V; Current - Test: 20mA; Viewing Angle: 140°; Lens Type: Clear; Lens Style/Size: Rectangle with Flat Top, 1.1mm x 0.7mm; Other Names: 732-4971-2; Supplier 1: Digi-Key; Manufacturer Part Number: 150060GS75000; Stock 1: 34964; Pricing 1: 1=0.14, 50=0.129, 100=0.11, 500=0.095 (USD); Standard Package: 4,000; Category: Optoelectronics; Family: LED Indication - Discrete; Series: WL-SMCW; Packaging: Tape & Reel (TR); Color: Green; Wavelength - Dominant: 520nm; Millicandela Rating: 430mcd; Package / Case: 0603 (1608 Metric); Size / Dimension: 1.60mm L x 0.80mm W; Height: 0.70mm; Mounting Type: Surface Mount; Online Catalog: 0603 Rectangle with Flat Top Chip LEDs; ComponentLink1URL: https://katalog.we-online.de/led/datasheet/150060GS75000.pdf?src-supplier=Digi-Key; ComponentLink1Description: https://katalog.we-online.de/led/datasheet/150060GS75000.pdf?src-supplier=Digi-Key; ComponentLink2URL: http://www.produktinfo.conrad.com/datenblaetter/750000-774999/759427-da-01-en-CHIPLED_0603_W_KL_GRUEN_150060GS75000.pdf?src-supplier=Conrad; ComponentLink2Description: http://www.produktinfo.conrad.com/datenblaetter/750000-774999/759427-da-01-en-CHIPLED_0603_W_KL_GRUEN_150060GS75000.pdf?src-supplier=Conrad; Supplier Part Number 1: 732-4971-1-ND
R7 R8 R25 = RNCP0603FTD10K0: as R3 on sheet Sensors; Supplier 1: Digi-Key; Manufacturer Part Number: RNCP0603FTD10K0; RoHS: Yes; Category: Chip SMD Resistors; Stock 1: 9; Pricing 1: 1=0.10000, 10=0.06100, 100=0.02480, 1000=0.01113, 2500=0.00966 (USD); Mount: Surface Mount; Case/Package: 0603; Case Code (Metric): 1608; Case Code (Imperial): 0603; Contact Plating: Tin,Matte; Min Operating Temperature: -55°C; Max Operating Temperature: 155°C; Packaging: Tape and Reel; Tolerance: 1%; Resistor Type: Thin Film; Number of Terminations: 2; Temperature Coefficient: 100ppm/°C; Features: Moisture Resistant,Anti-Sulfur; Series: RNCP; Length: 0.059inch; Width: 0.031inch; Height: 0.02inch; Radiation Hardening: No; Lead Free: Lead Free; RoHS Compliant: Yes; ComponentLink1URL: https://www.seielect.com/Catalog/SEI-rncp.pdf?src-supplier=Avnet; ComponentLink1Description: https://www.seielect.com/Catalog/SEI-rncp.pdf?src-supplier=Avnet; ComponentLink2URL: https://www.seielect.com/Catalog/SEI-rncp.pdf?src-supplier=Digi-Key; ComponentLink2Description: https://www.seielect.com/Catalog/SEI-rncp.pdf?src-supplier=Digi-Key; ComponentLink3URL: https://www.seielect.com/catalog/SEI-Packaging.pdf?src-supplier=Digi-Key; ComponentLink3Description: https://www.seielect.com/catalog/SEI-Packaging.pdf?src-supplier=Digi-Key; Supplier Part Number 1: RNCP0603FTD10K0CT-ND
R24 R26 = RMCF0603FT3K30: Res Thick Film 0603 3.3K Ohm 1% 0.1W(1/10W) ±100ppm/C Pad SMD Automotive T/R; Manufacturer: Stackpole Electronics; Resistance: 3.3kR; Max Power Dissipation: 100mW; Temperature Coefficient: 100ppm/°C; Supplier 1: Digi-Key; Manufacturer Part Number: RMCF0603FT3K30; RoHS: Yes; Category: Chip SMD Resistors; Stock 1: 471315; Pricing 1: 1=0.10000, 10=0.01700, 100=0.00680, 1000=0.00305, 2500=0.00264 (USD); Mount: Surface Mount; Case/Package: 0603; Case Code (Metric): 1608; Case Code (Imperial): 0603; Contact Plating: Tin,Matte; Min Operating Temperature: -55°C; Max Operating Temperature: 155°C; Packaging: Tape and Reel; Tolerance: 1%; Resistor Type: Thick Film; Number of Terminations: 2; Features: Automotive AEC-Q200; Series: RMCF; Construction: Rectangular; Length: 0.061inch; Width: 0.031inch; Height: 0.022inch; Depth: 0.8mm; Radiation Hardening: No; Military Standard: Not; RoHS Compliant: Yes; ComponentLink1URL: https://datasheet.ciiva.com/15193/getdatasheetpartid-376121-15193477.pdf?src-supplier=Verical; ComponentLink1Description: https://datasheet.ciiva.com/15193/getdatasheetpartid-376121-15193477.pdf?src-supplier=Verical; Supplier Part Number 1: RMCF0603FT3K30CT-ND
SW3 = RKB2SJM250SMTR LFS (2): as SW1 on sheet Microcontroller_Power_&_RF; Supplier 1: Digi-Key; Manufacturer Part Number: RKB2SJM250SMTR LFS; Category: Connectors; Stock 1: 5895; Pricing 1: 1=0.19000, 10=0.18600, 25=0.17640, 100=0.16050, 250=0.15088, 500=0.13804, 1000=0.11556 (USD); ComponentLink1URL: https://datasheet.octopart.com/RKB2SJM250SMTR-LFS-C%26K-Components-datasheet-151570462.pdf?src-supplier=Allied+Electronics; ComponentLink1Description: https://datasheet.octopart.com/RKB2SJM250SMTR-LFS-C%26K-Components-datasheet-151570462.pdf?src-supplier=Allied+Electronics; Supplier Part Number 1: 108-RKB2SJM250SMTRLFSCT-ND
TP1 TP2 = Test_Pad
U1 = EFR32BG13P732F512GM48-DR: as U1 on sheet Microcontroller_Power_&_RF; Supplier 1: Digi-Key; Manufacturer Part Number: EFR32BG13P732F512GM48-DR; Category: RF Receivers, Transceivers; ComponentLink1URL: https://datasheet.octopart.com/EFR32BG13P732F512GM48-DR-Silicon-Labs-datasheet-150822224.pdf?src-supplier=Silicon+Labs; ComponentLink1Description: https://datasheet.octopart.com/EFR32BG13P732F512GM48-DR-Silicon-Labs-datasheet-150822224.pdf?src-supplier=Silicon+Labs; ComponentLink2URL: https://datasheet.octopart.com/EFR32BG13P732F512GM48-DR-Silicon-Labs-datasheet-142345357.pdf?src-supplier=Silicon+Labs+SCT; ComponentLink2Description: https://datasheet.octopart.com/EFR32BG13P732F512GM48-DR-Silicon-Labs-datasheet-142345357.pdf?src-supplier=Silicon+Labs+SCT; ComponentLink3URL: https://datasheet.octopart.com/EFR32BG13P732F512GM48-DR-Silicon-Labs-datasheet-150822225.pdf?src-supplier=Farnell; ComponentLink3Description: https://datasheet.octopart.com/EFR32BG13P732F512GM48-DR-Silicon-Labs-datasheet-150822225.pdf?src-supplier=Farnell; Supplier Part Number 1: EFR32BG13P732F512GM48-DR-ND
X2 = ECS-.327-7-34B-TR: 32.768kHz Â±20ppm Crystal 7pF 70 kOhms 2-SMD, No Lead; MF: ECS Inc.; Availability: Unavailable; MP: ECS-.327-7-34B-TR; Price: None; Value: *; SnapEDA_Link: https://www.snapeda.com/parts/ECS-.327-7-34B-TR/ECS%20Inc./view-part/55054/?ref=snap; Package: SMD-2 ECS International

## Nets that join several sheets
+3V3_VMCU: Power_Management (J4.1 R14.2), Microcontroller_Power_&_RF (6 pins), Sensors (24 pins), Microcontroller_IO (6 pins)
GND: Power_Management (34 pins), Microcontroller_Power_&_RF (23 pins), Sensors (41 pins), Microcontroller_IO (H2.2 LED1.C R25.2)
DISP_EXTCOMIN: Sensors (J9.1 LCD1.4), Microcontroller_IO (U1.22)
DISP_SCLK: Sensors (J9.4 LCD1.1), Microcontroller_IO (U1.45)
DISP_SCS: Sensors (J9.2 LCD1.3), Microcontroller_IO (U1.23)
DISP_SI: Sensors (J9.3 LCD1.2), Microcontroller_IO (U1.43)
GPS_RX: Sensors (J7.2 J10.2 R5.2), Microcontroller_IO (U1.25)
GPS_TX: Sensors (J7.3 J10.3 R6.2), Microcontroller_IO (U1.26)
INT: Sensors (U2.14), Microcontroller_IO (U1.4)
RST: Microcontroller_Power_&_RF (C29.1 SW1.1 SW1.2 U1.12), Microcontroller_IO (H2.3)
SCL: Sensors (J6.1 J8.4 R30.1 R33.2), Microcontroller_IO (R7.1 U1.47)
SDA: Sensors (J6.2 J8.3 R31.1 R32.2), Microcontroller_IO (R8.1 U1.48)
VDISP: Sensors (C32.1 LCD1.5), Microcontroller_IO (U1.24)